# Altium project Переходник IDC50 на датчик.PrjPcb
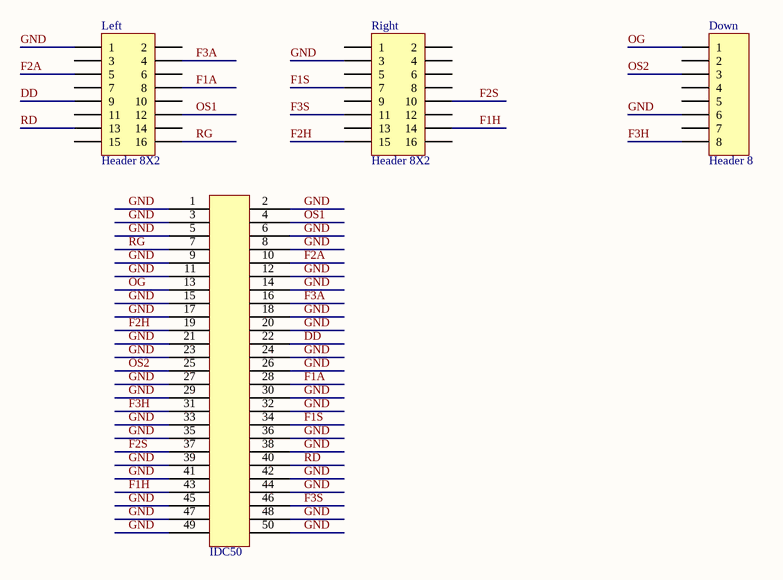
[diagram p0: IDC50ToSensor.SchDoc]
1 sheet, 4 parts. Net scope: global (net labels, ports and power ports of the same name join across sheets).
Board file: IDC50ToSensor.PcbDoc

## Sheet IDC50ToSensor.SchDoc
size A4; SheetNumber: 1; SheetTotal: 1

### Parts
*  IDC50  [IDC50]
Down  Header 8  [HDR1X8]
Left  Header 8X2  [HDR2X8]
Right  Header 8X2  [HDR2X8]

### Nets
DD: *.22 Left.9
F1A: *.28 Left.8
F1H: *.43 Right.14
F1S: *.34 Right.7
F2A: *.10 Left.5
F2H: *.19 Right.15
F2S: *.37 Right.10
F3A: *.16 Left.4
F3H: *.31 Down.8
F3S: *.46 Right.11
GND: *.1 *.2 *.3 *.5 *.6 *.8 *.9 *.11 *.12 *.14 *.15 *.17 *.18 *.20 *.21 *.23 *.24 *.26 *.27 *.29 *.30 *.32 *.33 *.35 *.36 *.38 *.39 *.41 *.42 *.44 *.45 *.47 *.48 *.49 *.50 Down.6 Left.1 Right.3
OG: *.13 Down.1
OS1: *.4 Left.12
OS2: *.25 Down.3
RD: *.40 Left.13
RG: *.7 Left.16

Not connected (* = marked no-connect by the designer): Down 2 4 5 7; Left 2 3 6 7 10 11 14 15; Right 1 2 4 5 6 8 9 12 13 16

### Library data of the parts
Down = Header 8: Header, 8-Pin; LatestRevisionDate: 17-Jul-2002; LatestRevisionNote: Re-released for DXP Platform.; Publisher: Altium Limited
Left Right = Header 8X2: Header, 8-Pin, Dual row; LatestRevisionDate: 17-Jul-2002; LatestRevisionNote: Re-released for DXP Platform.; Publisher: Altium Limited